# EasyEDA Pro project ProPrj_初级项目_2026-01-11.epro, board PCB1
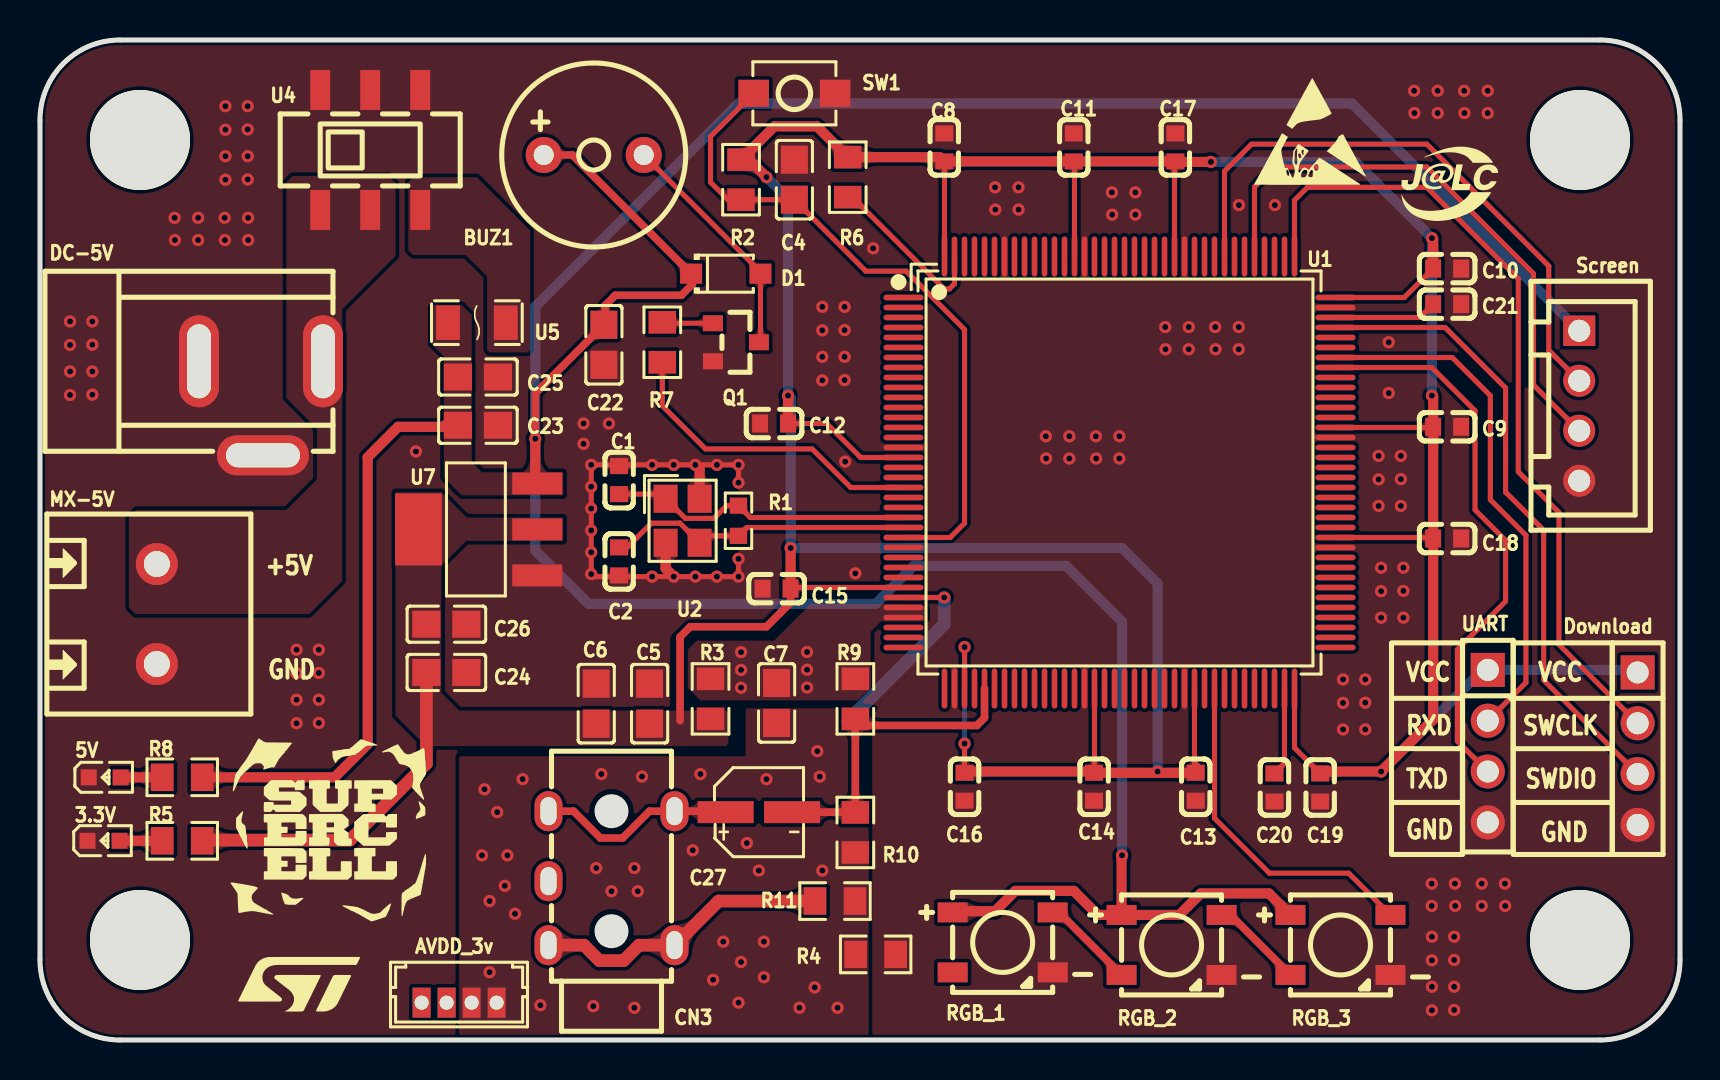
[diagram p8: board, top side]
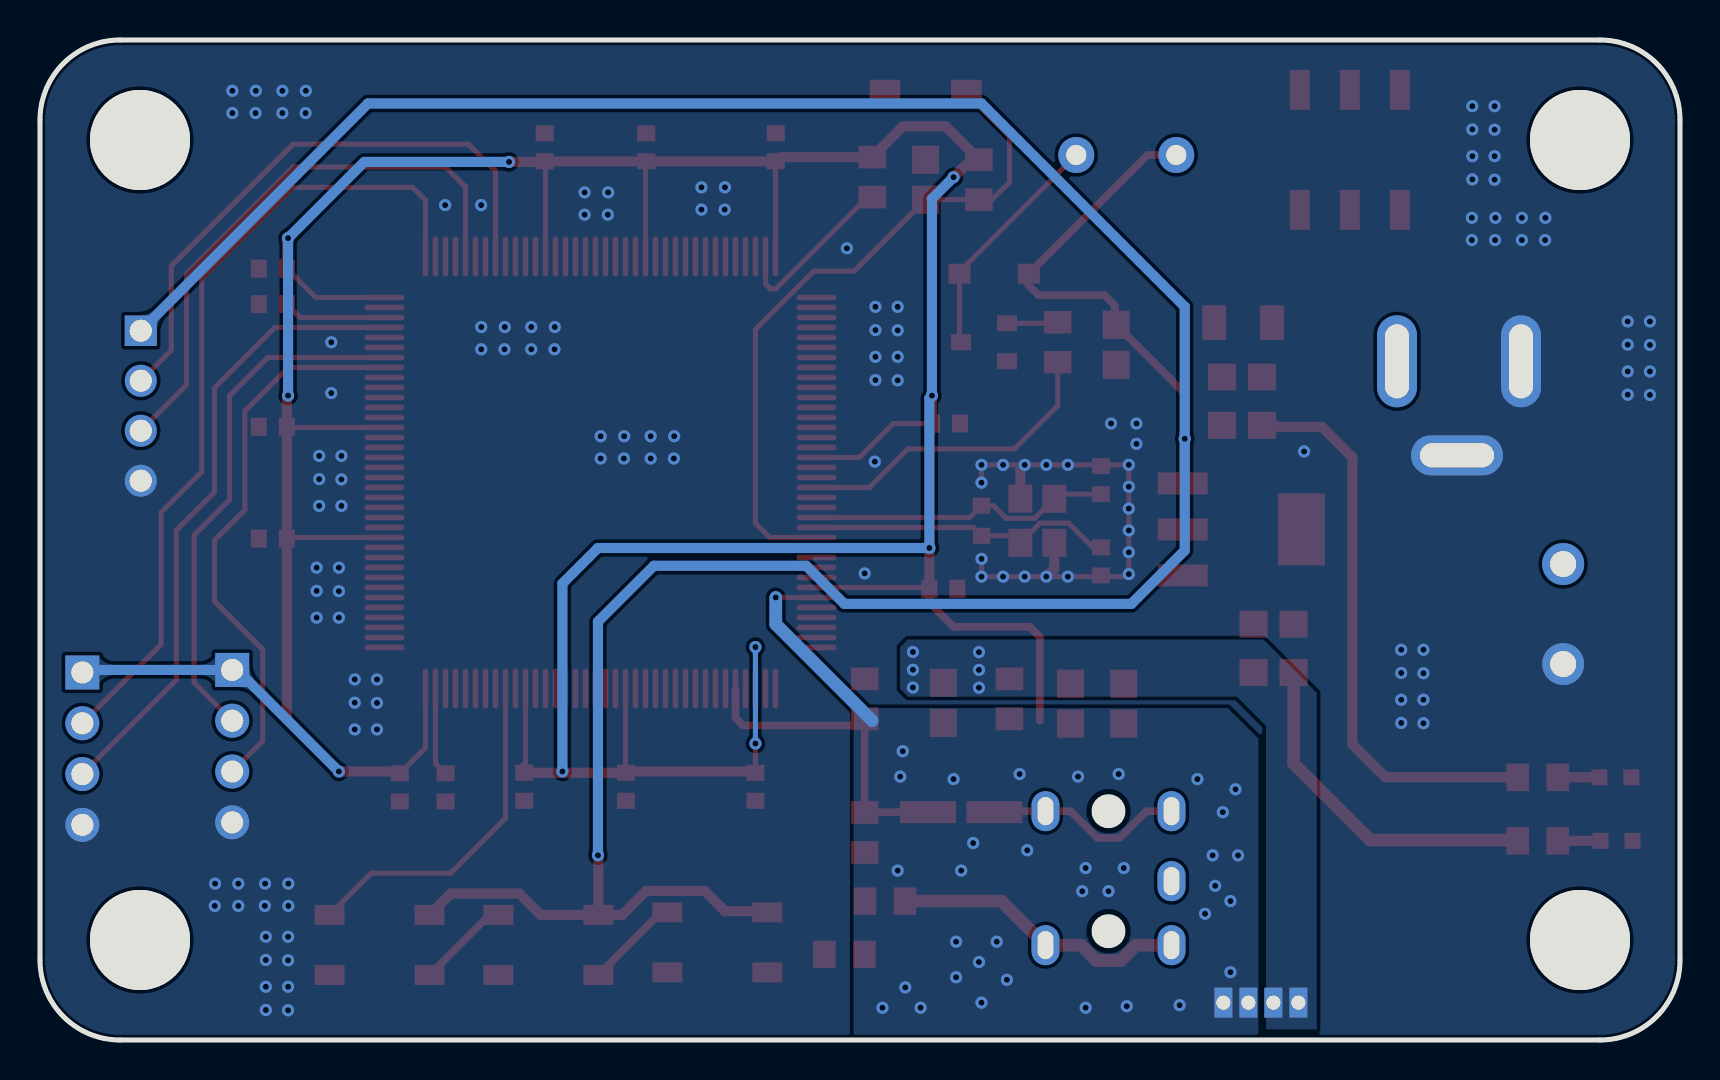
[diagram p9: board, bottom side, seen from below]

Outline 82 x 50 mm; copper layers: Top Layer, Bottom Layer. Coordinates in mm from the lower left corner of the outline.
Outline path: 0,46 0,4 arc(1.17,1.17) 4,0 78,0 arc(80.83,1.17) 82,4 82,46 arc(80.83,48.83) 78,50 4,50 arc(1.17,48.83) 0,46
Stack: Top Layer 0.035mm / Dielectric1 1.51mm FR4 er 4.5 / Bottom Layer 0.035mm

## Design rules (mm)
template: 自定义配置
spacing copperThickness1oz (default): track to track 0.102, other pairs 0.152 to 0.3
spacing copperThickness2oz: track to track 0.203, other pairs 0.152 to 0.3
track width copperThickness1oz (default): min 0.127, default 0.254, max 2.54
track width copperThickness2oz: min 0.203, default 0.254, max 2.54
differential pair differentialPair (default): width min 0.127, default 0.254, max 2.54; gap min 0.152, default 0.152
via viaSize (default): diameter min 0.5, default 0.61, max 10; hole min 0.3, default 0.305, max 6.299

## Placement (name value [footprint] x y rotation side)
3.3V  LTST-C190GKT  [LED0603-RD]  3.17 9.96 0 top
5V  LTST-C190GKT  [LED0603-RD]  3.23 13.13 0 top
AVDD_3v  WAFER-MX1.25-4PZZ  [CONN-TH_4P-P1.25_WAFER-MX1.25-4PZZ]  20.96 1.87 180 top
BUZ1  蜂鸣器  [BUZ-TH_BD9.0-P5.00-D0.6-FD]  27.69 44.25 0 top
C1  22pF  [C0603]  28.96 27.99 270 top
C2  22pF  [C0603]  28.96 23.93 90 top
C4  100nF  [C0805]  37.72 43.02 270 top
C5  100nF  [C0805]  30.48 16.82 270 top
C6  10uF  [C0805]  27.81 16.82 270 top
C7  2.2uF  [C0805]  36.83 16.85 90 top
C8  100nF  [C0603]  45.21 44.63 270 top
C9  100nF  [C0603]  70.36 30.66 180 top
C10  100nF  [C0603]  70.36 38.57 180 top
C11  100nF  [C0603]  51.69 44.63 270 top
C12  100nF  [C0603]  36.7 30.82 0 top
C13  100nF  [C0603]  57.78 12.66 90 top
C14  100nF  [C0603]  52.71 12.66 90 top
C15  100nF  [C0603]  36.83 22.57 0 top
C16  100nF  [C0603]  46.23 12.66 90 top
C17  100nF  [C0603]  56.77 44.63 270 top
C18  100nF  [C0603]  70.36 25.07 180 top
C19  100nF  [C0603]  64.01 12.63 90 top
C20  2.2uF  [C0603]  61.72 12.63 90 top
C21  2.2uF  [C0603]  70.36 36.79 180 top
C22  100nF  [C0805]  28.19 34.76 90 top
C23  100nF  [C0805]  21.9 30.74 180 top
C24  100nF  [C0805]  20.32 18.38 180 top
C25  10uF  [C0805]  21.9 33.15 180 top
C26  10uF  [C0805]  20.32 20.79 180 top
C27  10uF  [CAP-SMD_BD4.0-L4.3-W4.3-FD]  35.94 11.39 0 top
CN3  PJ-313 5JCJ  [AUDIO-TH_PJ-313_5JCJ]  28.57 8.09 90 top
D1  1N4148W  [SOD-123F_L2.7-W1.6-LS3.8-RD]  34.29 38.32 0 top
DC-5V  -  [DC-005_2.5]  10.92 33.62 180 top
Download  -  [HDR-TH_4P-P2.54-V-F]  79.88 14.57 270 top
MX-5V  MX128-5.0-02P-GN01-Cu-Y-A  [CONN-TH_2P-P5.00_MX128-5.0-02P-GN01-CU-Y-A]  5.84 21.3 270 top
Q1  -  [S8050_SOT-23]  34.8 35.01 180 top
R1  1M  [R0603]  34.93 25.96 90 top
R2  10K  [R0805]  35.05 43.02 90 top
R3  0R  [R0805]  33.53 17.06 90 top
R4  0R  [R0805]  41.78 4.28 180 top
R5  2k  [R0805]  7.11 9.96 0 top
R6  0R  [R0805]  40.39 43.14 90 top
R7  1K  [R0805]  31.12 34.89 90 top
R8  5.1k  [R0805]  7.11 13.14 0 top
R9  100K  [R0805]  40.77 17.06 90 top
R10  100K  [R0805]  40.77 10.38 90 top
R11  100K  [R0805]  39.75 6.95 0 top
RGB_1  XL-5050RGBC-WS2812B  [LED-SMD_4P-L5.0-W5.0-BL_XL-5050RGBC]  48.13 4.88 270 top
RGB_2  XL-5050RGBC-WS2812B  [LED-SMD_4P-L5.0-W5.0-BL_XL-5050RGBC]  56.58 4.75 270 top
RGB_3  XL-5050RGBC-WS2812B  [LED-SMD_4P-L5.0-W5.0-BL_XL-5050RGBC]  65.02 4.75 270 top
Screen  ZX-XH2.54-4PZZ  [CONN-TH_4P-P2.50_4PIN]  76.96 31.71 270 top
SW1  -  [Key_SMD_3x4x2]  37.72 47.33 180 top
U1  STM32F407ZGT6  [LQFP-144_L20.0-W20.0-P0.50-LS22.0-BL]  53.97 28.38 270 top
U2  8MHz  [CRYSTAL-SMD_4P-L3.2-W2.5-BL]  32.13 25.96 270 top
U4  YSSP2AG00  [SW-SMD_YSSP2AG00]  16.51 44.5 0 top
U5  JK-nSMD005/60V  [F1206]  21.84 35.87 180 top
U7  AMS1117-3.3  [SOT-223-3_L6.5-W3.4-P2.30-LS7.0-BR]  21.9 25.53 0 top
U12  -  [固定孔]  5 45 0 top
U13  -  [固定孔]  5 5 0 top
U14  -  [固定孔]  77 45 0 top
U15  -  [固定孔]  77 5 0 top
UART  -  [HDR-TH_4P-P2.54-V-F]  72.39 14.69 270 top

## Footprints (pads in the part's own frame, mm; a bottom-side part is the same pattern mirrored in y, then rotated)
AUDIO-TH_PJ-313_5JCJ
  oval 2x1.4 hole 1.4x0.8: 1(-3.35,3.15) 1(-3.35,-3.15) 2(3.35,3.15) 2(3.35,-3.15) 3(-0.15,3.15)
BUZ-TH_BD9.0-P5.00-D0.6-FD
  round 1.8 hole 1: 1(-2.5,0) 2(2.5,0)
C0603
  rect 0.8x0.9 smd: 1(-0.7,0) 2(0.7,0)
C0805
  rect 1.41x1.35 smd: 1(-1,0) 2(1,0)
CAP-SMD_BD4.0-L4.3-W4.3-FD
  rect 2.8x1.1 smd: 1(-1.661,0) 2(1.661,0)
CONN-TH_2P-P5.00_MX128-5.0-02P-GN01-CU-Y-A
  round 2.1 hole 1.3: 1(-2.5,0) 2(2.5,0)
CONN-TH_4P-P1.25_WAFER-MX1.25-4PZZ
  rect 0.9x1.5 hole 0.7: 1(1.875,0) 2(0.625,0) 3(-0.625,0) 4(-1.875,0)
CONN-TH_4P-P2.50_4PIN
  rect 1.524x1.6 hole 1.1: 1(-3.75,0)
  round 1.6 hole 1.1: 2(-1.25,0) 3(1.25,0) 4(3.75,0)
CRYSTAL-SMD_4P-L3.2-W2.5-BL
  rect 1.4x1.2 smd: 1(-1.1,-0.85) 2(1.1,-0.85) 3(1.1,0.85) 4(-1.1,0.85)
DC-005_2.5
  oval 2x4.6 hole 1.2x3.7: 1(-3.227,-0.318) 2(2.973,-0.318)
  oval 4.6x2 hole 3.7x1.2: 3(-0.227,4.382)
F1206
  rect 1.19x1.728 smd: 1(-1.445,0) 2(1.445,0)
HDR-TH_4P-P2.54-V-F
  rect 1.7x1.7 hole 1.1: 1(-3.81,0)
  round 1.7 hole 1.1: 2(-1.27,0) 3(1.27,0) 4(3.81,0)
Key_SMD_3x4x2
  rect 1.53x1.36 smd: 1(-2.035,0) 2(2.035,0)
LED0603-RD
  rect 0.8x0.8 smd: 1(-0.799,0) 2(0.799,0)
LED-SMD_4P-L5.0-W5.0-BL_XL-5050RGBC
  rect 1x1.5 smd: 1(-1.5,-2.5) 2(1.5,-2.5) 3(1.5,2.5) 4(-1.5,2.5)
LQFP-144_L20.0-W20.0-P0.50-LS22.0-BL
  oval 0.28x2 smd: 1(-8.75,-10.8) 2(-8.25,-10.8) 3(-7.75,-10.8) 4(-7.25,-10.8) 5(-6.75,-10.8) 6(-6.25,-10.8) 7(-5.75,-10.8) 8(-5.25,-10.8) 9(-4.75,-10.8) 10(-4.25,-10.8) 11(-3.75,-10.8) 12(-3.25,-10.8) 13(-2.75,-10.8) 14(-2.25,-10.8) 15(-1.75,-10.8) 16(-1.25,-10.8) 17(-0.75,-10.8) 18(-0.25,-10.8) 19(0.25,-10.8) 20(0.75,-10.8) 21(1.25,-10.8) 22(1.75,-10.8) 23(2.25,-10.8) 24(2.75,-10.8) 25(3.25,-10.8) 26(3.75,-10.8) 27(4.25,-10.8) 28(4.75,-10.8) 29(5.25,-10.8) 30(5.75,-10.8) 31(6.25,-10.8) 32(6.75,-10.8) 33(7.25,-10.8) 34(7.75,-10.8) 35(8.25,-10.8) 36(8.75,-10.8) 73(8.75,10.8) 74(8.25,10.8) 75(7.75,10.8) 76(7.25,10.8) 77(6.75,10.8) 78(6.25,10.8) 79(5.75,10.8) 80(5.25,10.8) 81(4.75,10.8) 82(4.25,10.8) 83(3.75,10.8) 84(3.25,10.8) 85(2.75,10.8) 86(2.25,10.8) 87(1.75,10.8) 88(1.25,10.8) 89(0.75,10.8) 90(0.25,10.8) 91(-0.25,10.8) 92(-0.75,10.8) 93(-1.25,10.8) 94(-1.75,10.8) 95(-2.25,10.8) 96(-2.75,10.8) 97(-3.25,10.8) 98(-3.75,10.8) 99(-4.25,10.8) 100(-4.75,10.8) 101(-5.25,10.8) 102(-5.75,10.8) 103(-6.25,10.8) 104(-6.75,10.8) 105(-7.25,10.8) 106(-7.75,10.8) 107(-8.25,10.8) 108(-8.75,10.8)
  oval 2x0.28 smd: 37(10.8,-8.75) 38(10.8,-8.25) 39(10.8,-7.75) 40(10.8,-7.25) 41(10.8,-6.75) 42(10.8,-6.25) 43(10.8,-5.75) 44(10.8,-5.25) 45(10.8,-4.75) 46(10.8,-4.25) 47(10.8,-3.75) 48(10.8,-3.25) 49(10.8,-2.75) 50(10.8,-2.25) 51(10.8,-1.75) 52(10.8,-1.25) 53(10.8,-0.75) 54(10.8,-0.25) 55(10.8,0.25) 56(10.8,0.75) 57(10.8,1.25) 58(10.8,1.75) 59(10.8,2.25) 60(10.8,2.75) 61(10.8,3.25) 62(10.8,3.75) 63(10.8,4.25) 64(10.8,4.75) 65(10.8,5.25) 66(10.8,5.75) 67(10.8,6.25) 68(10.8,6.75) 69(10.8,7.25) 70(10.8,7.75) 71(10.8,8.25) 72(10.8,8.75) 109(-10.8,8.75) 110(-10.8,8.25) 111(-10.8,7.75) 112(-10.8,7.25) 113(-10.8,6.75) 114(-10.8,6.25) 115(-10.8,5.75) 116(-10.8,5.25) 117(-10.8,4.75) 118(-10.8,4.25) 119(-10.8,3.75) 120(-10.8,3.25) 121(-10.8,2.75) 122(-10.8,2.25) 123(-10.8,1.75) 124(-10.8,1.25) 125(-10.8,0.75) 126(-10.8,0.25) 127(-10.8,-0.25) 128(-10.8,-0.75) 129(-10.8,-1.25) 130(-10.8,-1.75) 131(-10.8,-2.25) 132(-10.8,-2.75) 133(-10.8,-3.25) 134(-10.8,-3.75) 135(-10.8,-4.25) 136(-10.8,-4.75) 137(-10.8,-5.25) 138(-10.8,-5.75) 139(-10.8,-6.25) 140(-10.8,-6.75) 141(-10.8,-7.25) 142(-10.8,-7.75) 143(-10.8,-8.25) 144(-10.8,-8.75)
R0603
  rect 0.806x0.864 smd: 1(-0.753,0) 2(0.753,0)
R0805
  rect 1.133x1.377 smd: 1(-1,0) 2(1,0)
S8050_SOT-23
  rect 1x0.8 smd: 1(1.15,-0.823) 2(1.15,1.077) 3(-1.15,0.127)
SOD-123F_L2.7-W1.6-LS3.8-RD
  rect 1.1x1 smd: 1(-1.735,0) 2(1.735,0)
SOT-223-3_L6.5-W3.4-P2.30-LS7.0-BR
  rect 2.5x1.1 smd: 1(2.97,-2.3) 2(2.97,0) 3(2.97,2.3)
  rect 2.34x3.6 smd: 4(-2.97,0)
SW-SMD_YSSP2AG00
  rect 1x2 smd: 1(-2.5,3) 2(0,3) 3(2.5,3) 4(-2.5,-3) 5(0,-3) 6(2.5,-3)
固定孔
  round 5 hole 5x3: 1(0,0)

## Nets
As in the schematic.

Pads without a net: CN3 3; RGB_1 2; U1 6; U12 1; U13 1; U14 1; U15 1

## Via types
v1: diameter 0.61, hole 0.305, Top Layer to Bottom Layer, 189 vias

## Routing (per net, layer and track width the routed paths; a pad name or vN(x,y) marks a point on that pad's centre or on a via; arc(x,y) is an arc through that point)
AGND: length 10.2
  Top Layer w0.254: 43.18,22.12 v1(45.21,22.12)
  Bottom Layer w0.635: 40.39,15.96 45.21,20.79 v1(45.21,22.12)
  vias: v1(22.1,9.23) v1(22.22,12.53) v1(22.48,6.95) v1(22.48,3.39) v1(22.86,11.39) v1(23.24,7.71) v1(23.37,9.23) v1(23.75,6.31) v1(24.13,13.04) v1(25.02,1.74) v1(27.66,1.69) v1(27.81,8.6) v1(28.07,13.3) v1(28.57,7.44) v1(29.72,8.6) v1(29.72,1.61) v1(29.89,7.44) v1(30.1,13.17) v1(32.64,9.49) v1(33.02,13.3) v1(33.66,3.01) v1(34.16,4.92) v1(34.93,1.87) v1(35.05,3.9) v1(35.34,9.85) v1(35.94,8.47) v1(36.19,4.92) v1(36.19,3.14) v1(36.32,13.04) v1(37.97,1.61) v1(38.74,2.63) v1(38.86,14.44) v1(38.99,13.17) v1(39.12,8.47) v1(39.88,1.61)
GND: length 25.7
  Top Layer w0.254: v1(34.93,27.87) v1(34.93,28.76) v1(33.85,28.76) v1(32.77,28.76) v1(31.69,28.76) v1(30.61,28.76) v1(27.56,28.76) v1(27.56,27.66) v1(27.56,26.57) v1(27.56,25.48) v1(27.56,24.39) v1(27.56,23.3) 27.69,23.17 v1(30.61,23.17) v1(31.69,23.17) v1(32.77,23.17) v1(33.85,23.17) v1(34.93,23.17) v1(34.93,24.06)
  Top Layer w0.508: U2.4 32.98,28.54 v1(32.77,28.76) ; U2.2 31.28,23.57 v1(31.69,23.17)
  vias: v1(1.5,35.93) v1(1.5,34.75) v1(1.5,33.43) v1(1.5,32.25) v1(2.62,35.93) v1(2.62,34.77) v1(2.62,33.43) v1(2.62,32.27) v1(6.73,41.11) v1(6.75,40) v1(7.91,41.11) v1(7.91,40) v1(9.23,41.11) v1(9.25,40) v1(9.27,46.69) v1(9.27,45.52) v1(9.27,44.19) v1(9.27,43.02) v1(10.38,46.69) v1(10.38,45.53) v1(10.38,44.19) v1(10.38,43.03) v1(10.41,41.11) v1(10.41,40) v1(12.83,19.51) v1(12.83,18.34) v1(12.83,17.01) v1(12.83,15.84) v1(13.94,19.51) v1(13.94,18.35) v1(13.94,17.01) v1(13.94,15.85) v1(18.8,29.43) v1(27.18,30.82) v1(27.18,29.81) v1(28.45,30.82) v1(39.12,36.66) v1(39.12,35.48) v1(39.12,34.16) v1(39.12,32.98) v1(40.23,36.66) v1(40.23,35.5) v1(40.23,34.16) v1(40.23,33) v1(40.26,28.92) v1(40.77,23.33) v1(41.66,39.59) v1(47.75,42.63) v1(47.77,41.52) v1(48.93,42.63) v1(48.93,41.52) v1(50.29,30.19) v1(50.31,29.08) v1(51.47,30.19) v1(51.47,29.08) v1(52.79,30.19) v1(52.81,29.08) v1(53.59,42.38) v1(53.61,41.27) v1(53.97,30.19) v1(53.97,29.08) v1(54.77,42.38) v1(54.77,41.27) v1(56.26,35.65) v1(56.28,34.54) v1(57.44,35.65) v1(57.44,34.54) v1(58.76,35.65) v1(58.78,34.54) v1(59.94,41.75) v1(59.94,35.65) v1(59.94,34.54) v1(61.74,41.75) v1(65.15,18.03) v1(65.15,16.85) v1(65.15,15.53) v1(66.26,18.03) v1(66.26,16.87) v1(66.26,15.53) v1(66.93,29.2) v1(66.93,28.03) v1(66.93,26.7) v1(67.06,23.62) v1(67.06,22.44) v1(67.06,21.12) v1(67.44,34.89) v1(67.44,32.35) v1(68.04,29.2) v1(68.04,28.04) v1(68.04,26.7) v1(68.17,23.62) v1(68.17,22.46) v1(68.17,21.12) v1(68.71,47.46) v1(68.72,46.35) v1(69.58,7.82) v1(69.58,6.7) v1(69.6,5.16) v1(69.6,3.99) v1(69.6,2.66) v1(69.6,1.49) v1(69.88,47.46) v1(69.88,46.35) v1(70.75,7.82) v1(70.71,5.16) v1(70.71,4) v1(70.71,2.66) v1(70.71,1.5) v1(70.76,6.7) v1(71.21,47.46) v1(71.22,46.35) v1(72.09,7.82) v1(72.09,6.7) v1(72.38,47.46) v1(72.38,46.35) v1(73.25,7.82) v1(73.26,6.7)
VCC+3.3V: length 240.6
  Top Layer w0.254: U1.84 69.58,25.12 69.63,25.07 C18.2 ; C19.2 62.72,14.61 U1.72 ; U1.39 46.23,17.58 v1(46.23,19.65) ; U1.121 56.72,43.92 ; U1.144 45.22,43.92 ; U1.108 68.21,37.12 C10.2 ; 43.18,22.62 37.59,22.62 ; C11.2 51.72,43.89 U1.131 ; U1.62 57.72,13.7 57.78,13.64 C13.2 ; U1.52 52.72,13.38 C14.2 ; 43.18,29.12 41.03,29.12 39.34,30.82 C12.2 ; C16.2 v1(46.23,14.82) ; U1.95 69.62,30.62
  Top Layer w0.381: C15.2 37.53,21.87 36.32,20.66 32.51,20.66 32,20.16 32,15.96
  Top Layer w0.508: 56.73,43.93 56.77,43.97 ; 56.73,43.93 56.76,43.9 v1(58.55,43.9) ; 56.73,43.93 C11.2 C8.2 ; 69.62,30.62 69.66,30.59 C18.2 69.66,16.03 v1(67.06,13.42) 64.26,13.42 64.16,13.33 C19.2 ; v1(69.6,32.22) 69.66,32.16 C9.2 ; C10.2 69.66,40.03 v1(69.6,40.09) ; C15.2 v1(37.53,24.6) ; C16.2 46.29,13.36 46.35,13.42 52.64,13.42 C14.2 57.51,13.36 57.78,13.64 ; 45,44.14 R6.2 38.85,45.68 36.72,45.68 R2.2 35.45,44.02 v1(36.32,43.14) ; v1(37.4,32.22) C12.2
  Top Layer w0.635: R5.2 8.15,10 15.49,10 19.32,13.82 C24.2
  Bottom Layer w0.254: v1(46.23,14.82) v1(46.23,19.65)
  Bottom Layer w0.508: v1(67.06,13.42) 72.14,18.5 UART.1 79.76,18.5 Download.1 ; v1(55.88,13.42) 55.88,22.82 54.1,24.6 v1(37.53,24.6) 37.53,32.09 v1(37.4,32.22) 37.4,42.06 v1(36.32,43.14) ; v1(69.6,32.22) v1(69.6,40.09) 65.79,43.9 v1(58.55,43.9)
VCC+5V: length 193.1
  Top Layer w0.381: BUZ1.1 26.62,44.25 32.62,38.25 32.62,37.79 32.07,37.24 28.77,37.24 28.26,36.73 28.26,35.82 C22.2 24.76,32.33 v1(24.76,30.06)
  Top Layer w0.508: v1(54.1,9.23) 54.08,9.21 RGB_2.1 ; RGB_3.1 61.45,7.33 58.04,7.33 56.96,6.25 RGB_2.1 ; R8.2 14.73,13.14 16.38,14.79 16.38,29.14 17.91,30.66 20.19,30.66 20.26,30.74 C23.2 ; v1(24.76,30.06) 24.76,27.93 U7.3 ; RGB_2.1 52.89,6.25 51.69,7.45 48.77,7.45 47.75,6.44 45.69,6.44 RGB_1.1
  Bottom Layer w0.508: Screen.1 65.6,46.83 34.93,46.83 24.76,36.67 v1(24.76,30.06) 24.76,24.47 27.43,21.81 41.78,21.81 43.69,23.71 51.31,23.71 54.1,20.92 v1(54.1,9.23)
VDDA:
  vias: v1(35.05,19.39) v1(35.05,18.5) v1(35.05,17.61) v1(38.35,19.4) v1(38.35,18.51) v1(38.35,17.62)
ADC3: length 15.6
  Top Layer w0.381: U1.41 47.22,16.11 46.84,15.73 40.77,15.73 R10.2 40.75,11.39 C27.2
BUZZ: length 15.9
  Top Layer w0.254: 43.18,27.62 40.54,27.62 38.61,29.55 33.27,29.55 31.12,31.71 R7.1
PA9: length 28.2
  Top Layer w0.254: U1.101 69.59,33.62 71.75,31.46 71.75,26.5 73.28,24.98 73.28,21.93 70.87,19.52 70.87,14.95 UART.3
PA10: length 26.3
  Top Layer w0.254: UART.2 74.29,17.87 74.29,25.23 72.52,27.01 72.52,32.22 70.61,34.12 U1.102
PC12: length 28.9
  Top Layer w0.254: Screen.3 74.68,32.75 74.68,38.32 69.34,43.65 61.72,43.65 60.72,42.65 U1.113
PD2: length 29.9
  Top Layer w0.254: U1.116 59.22,43.44 60.58,44.79 69.34,44.79 75.44,38.7 75.44,34.49 Screen.2
PDR_ON: length 8.7
  Top Layer w0.254: U1.143 45.72,37.81 45.47,37.55 45.21,37.55 40.62,42.14 R6.1
PE11: length 17.3
  Top Layer w0.254: RGB_3.4 65.43,8.34 61.47,8.34 58.72,11.09 U1.64
PH0: length 15.2
  Top Layer w0.254: 43.18,26.12 35.52,26.12 R1.2 34.33,26.72 33.7,26.08 32.27,26.08 31.63,26.72 31.63,26.72 U2.1 31.05,27.29 C1.2
PH1: length 15.4
  Top Layer w0.254: C2.2 29.35,24.63 30.57,25.84 32,25.84 32.83,25.01 32.83,25.01 U2.3 33.33,25.21 R1.1 35.34,25.62 43.18,25.62
RESET: length 34.1
  Top Layer w0.254: SW1.2 33.53,45.18 33.53,42.89 34.4,42.02 R2.1 C4.2 41.29,38.44 43.31,38.44 46.23,35.53 46.23,25.84 45.51,25.12 43.18,25.12
SWCLK: length 40.9
  Top Layer w0.254: U1.109 62.72,41.99 63.37,42.63 69.34,42.63 73.91,38.06 73.91,28.41 75.95,26.38 75.95,19.77 Download.2
SWDIO: length 31.8
  Top Layer w0.254: Download.3 75.18,18 75.18,25.49 73.28,27.39 73.28,32.6 70.25,35.62 U1.105
VCAP1: length 4.5
  Top Layer w0.254: U1.71 62.22,13.83 C20.2
VCAP2: length 5.2
  Top Layer w0.254: U1.106 68.99,36.12 C21.2
$1N3648: length 11.8
  Top Layer w0.254: Q1.3 36.03,34.96 D1.2 36.03,38.41 BUZ1.2
$1N3672: length 2.6
  Top Layer w0.254: Q1.1 31.16,35.84 R7.2
$1N5975: length 14.9
  Top Layer w0.635: R11.1 33.93,6.95 CN3.1 29.95,4.74 29.18,3.97 27.97,3.97 27.2,4.74 CN3.1
$1N6999: length 4.7
  Top Layer w0.381: RGB_1.4 50.95,6.38 RGB_2.2
$1N7002: length 4.7
  Top Layer w0.381: RGB_3.2 59.52,6.25 RGB_2.4
$1N9505: length 10
  Top Layer w0.381: CN3.2 26.68,11.44 28.02,10.1 29.13,10.1 30.47,11.44 CN3.2 34.23,11.44 C27.1
$2N3690: length 2.1
  Top Layer w0.508: R5.1 3.3V.2
$2N3701: length 2.1
  Top Layer w0.508: 5V.2 4.04,13.14 R8.1

## Copper pours and planes (outline as drawn; the poured copper is in the pictures)
AGND on Top Layer: 20.95,0 41.43,0 41.43,16.33 41.68,16.58 35.28,16.58 35.28,14.19 20.96,14.19 20.96,0
AGND on Bottom Layer: 21.08,0 41.32,0 41.32,16.52 41.4,16.6 22.61,16.6 21.08,15.08
GND on Top Layer: -3.43,53.81 84.71,53.81 84.71,-6.01 -3.43,-6.01
GND on Top Layer: 27.56,28.76 34.93,28.76 34.93,23.17 27.56,23.17
GND on Bottom Layer: -4.44,53.68 85.85,53.68 85.85,-6.26 -4.44,-6.26
VCC+3.3V on Top Layer: 17.78,27.39 34.42,27.39 34.42,14.69 17.78,14.69
VCC+5V on Top Layer: 19.58,36.76 26.16,36.76 26.16,27.23 19.58,27.23
VDDA on Top Layer: 32.38,21.81 44.32,21.81 44.32,16.98 32.38,16.98
VDDA on Bottom Layer: 18.16,20.03 38.99,20.03 38.99,0.53 18.16,0.53
MX+5V on Top Layer: 4.44,43.2 17.78,43.2 17.78,21.3 4.44,21.3
$2N3532 on Top Layer: 18.41,43.14 24.51,43.14 24.51,34.38 18.41,34.38

Small or netless copper shapes (teardrops, artwork), in the pictures only: 173 on Top Layer, 20 on Bottom Layer

## Text on the board
Top Silkscreen Layer: +5V | GND | VCC | RXD | TXD | SWCLK | SWDIO
